# Altium schematic sheet Copy of esp32h2_light_sleep_AI.SchDoc
size A4; SheetNumber: 1; SheetTotal: 1
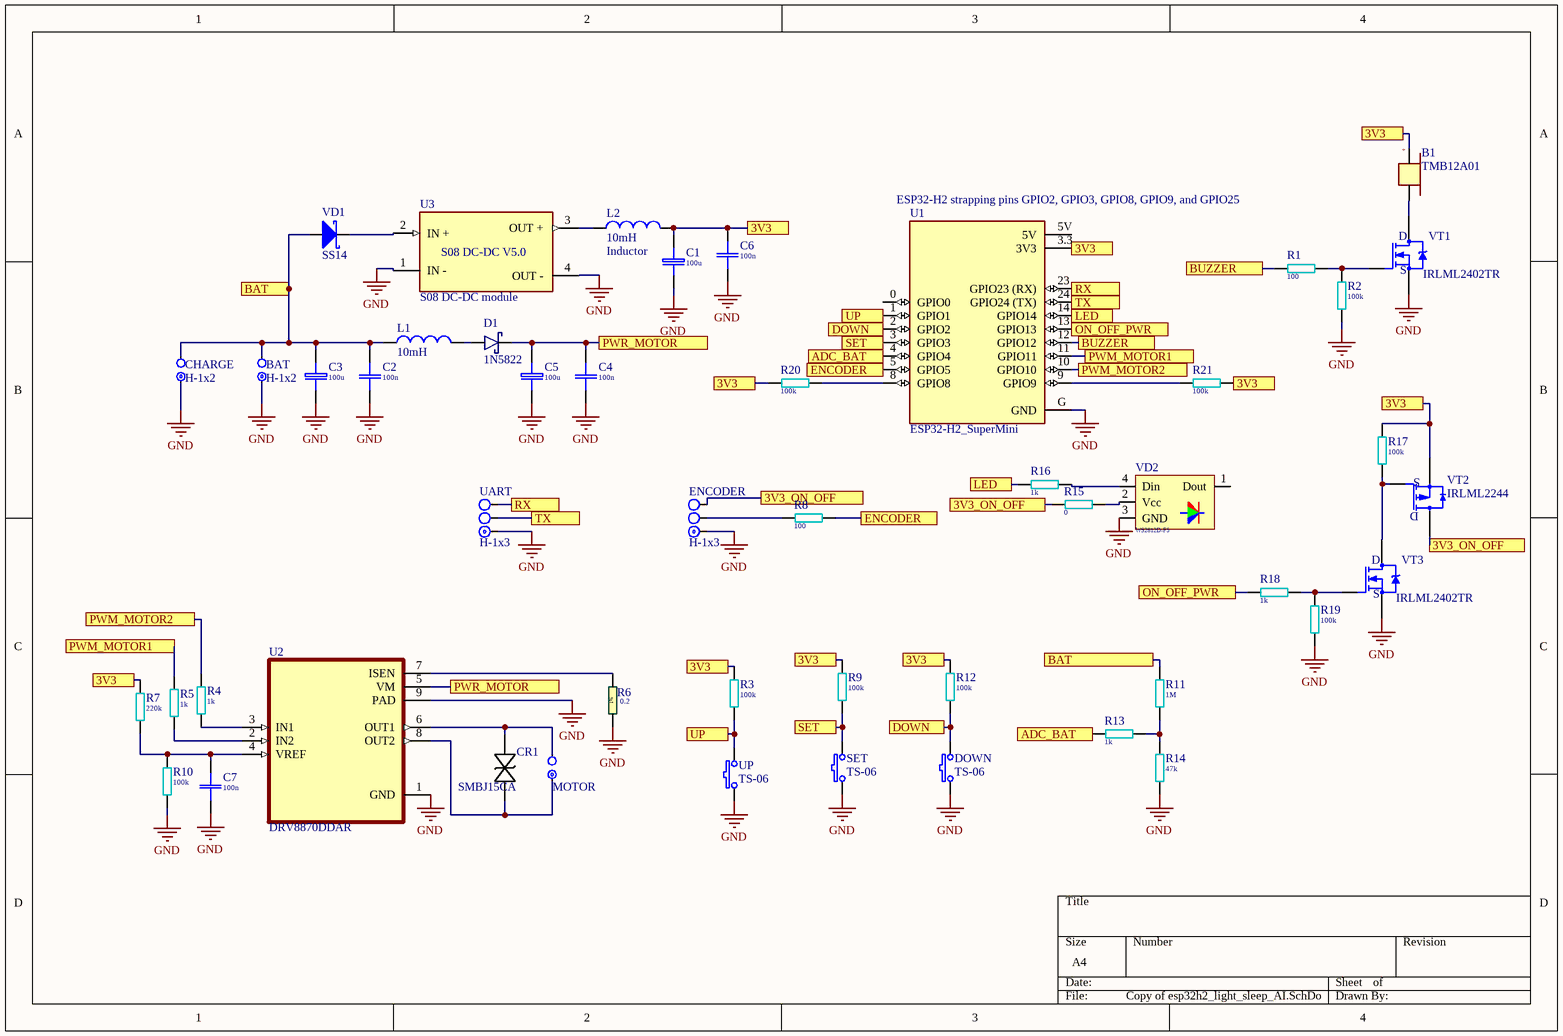
[diagram p0: Copy of esp32h2_light_sleep_AI.SchDoc]

## Parts
B1  value TMB12A01  [Buzzer_TMB12AXX]
BAT  H-1x2  [J1x2]
C1  100u  [EL SMD Case D D6.3x6.6 h7.7(0605)]
C2  100n  [C1206(3216)]
C3  100u  [EL SMD Case D D6.3x6.6 h7.7(0605)]
C4  100n  [C1206(3216)]
C5  100u  [EL SMD Case D D6.3x6.6 h7.7(0605)]
C6  100n  [C1206(3216)]
C7  100n  [C1206(3216)]
CHARGE  H-1x2  [J1x2]
CR1  SMBJ15CA  [DIODE_DO214AA]
D1  1N5822  [DO201AD]
DOWN  TS-06  [TS-06]
ENCODER  H-1x3  [J1x3]
L1  value 10mH  [AXIAL-10x0.8]
L2  Inductor  value 10mH  [AXIAL-10x0.8]
MOTOR  H-1x2  [J1x2]  (value not drawn)
R1  100  [R1206]
R2  100k  [R1206]
R3  100k  [R1206]
R4  1k  [R1206]
R5  1k  [R1206]
R6  0.2  [R2512-1%]
R7  220k  [R1206]
R8  100  [R1206]
R9  100k  [R1206]
R10  100k  [R1206]
R11  1M  [R1206]
R12  100k  [R1206]
R13  1k  [R1206]
R14  47k  [R1206]
R15  0  [R1206]
R16  1k  [R1206]
R17  100k  [R1206]
R18  1k  [R1206]
R19  100k  [R1206]
R20  100k  [R1206]
R21  100k  [R1206]
SET  TS-06  [TS-06]
U1  ESP32-H2_SuperMini  [ESP32-H2_SuperMini]
U2  DRV8870DDAR  [VREG_LM5017MR/NOPB]
U3  S08 DC-DC module  [S08 DC-DC module]
UART  H-1x3  [J1x3]
UP  TS-06  [TS-06]
VD1  SS14  [SMA]
VD2  value WS2812D-F5  [WS2812D-F5 DIP 4 pin]  (hidden comment: XT1511-4020)
VT1  IRLML2402TR  [SOT-23]
VT2  IRLML2244  [SOT-23]
VT3  IRLML2402TR  [SOT-23]

## Ports
3V3 (see esp32h2_light_sleep[1C], esp32h2_light_sleep[2A], esp32h2_light_sleep[2B], esp32h2_light_sleep[2C], esp32h2_light_sleep[3A], esp32h2_light_sleep[3C], esp32h2_light_sleep[4A], esp32h2_light_sleep[4B]), 3V3 (see esp32h2_light_sleep[1C], esp32h2_light_sleep[2A], esp32h2_light_sleep[2B], esp32h2_light_sleep[2C], esp32h2_light_sleep[3A], esp32h2_light_sleep[3C], esp32h2_light_sleep[4B]), 3V3 (see esp32h2_light_sleep[1C], esp32h2_light_sleep[2A], esp32h2_light_sleep[2B], esp32h2_light_sleep[2C], esp32h2_light_sleep[3C], esp32h2_light_sleep[4A], esp32h2_light_sleep[4B]), 3V3 (see esp32h2_light_sleep[1C], esp32h2_light_sleep[2A], esp32h2_light_sleep[2B], esp32h2_light_sleep[3A], esp32h2_light_sleep[3C], esp32h2_light_sleep[4A], esp32h2_light_sleep[4B]), 3V3 (see esp32h2_light_sleep[1C], esp32h2_light_sleep[2A], esp32h2_light_sleep[2C], esp32h2_light_sleep[3A], esp32h2_light_sleep[3C], esp32h2_light_sleep[4A], esp32h2_light_sleep[4B]), 3V3 (see esp32h2_light_sleep[1C], esp32h2_light_sleep[2B], esp32h2_light_sleep[2C], esp32h2_light_sleep[3A], esp32h2_light_sleep[3C], esp32h2_light_sleep[4A], esp32h2_light_sleep[4B]), 3V3 (see esp32h2_light_sleep[2A], esp32h2_light_sleep[2B], esp32h2_light_sleep[2C], esp32h2_light_sleep[3A], esp32h2_light_sleep[3C], esp32h2_light_sleep[4A], esp32h2_light_sleep[4B]), 3V3_ON_OFF (see esp32h2_light_sleep[2B], esp32h2_light_sleep[3B]), 3V3_ON_OFF (see esp32h2_light_sleep[2B], esp32h2_light_sleep[4C]), 3V3_ON_OFF (see esp32h2_light_sleep[3B], esp32h2_light_sleep[4C]), ADC_BAT (see esp32h2_light_sleep[3B]), ADC_BAT (see esp32h2_light_sleep[3C]), BAT (see esp32h2_light_sleep[1B]), BAT (see esp32h2_light_sleep[3C]), BUZZER (see esp32h2_light_sleep[3B]), BUZZER (see esp32h2_light_sleep[4B]), DOWN (see esp32h2_light_sleep[3B]), DOWN (see esp32h2_light_sleep[3C]), ENCODER (see esp32h2_light_sleep[3B]), ENCODER (see esp32h2_light_sleep[3C]), LED (see esp32h2_light_sleep[3B]), ON_OFF_PWR (see esp32h2_light_sleep[3B]), ON_OFF_PWR (see esp32h2_light_sleep[3C]), PWM_MOTOR1 (see esp32h2_light_sleep[1C]), PWM_MOTOR1 (see esp32h2_light_sleep[3B]), PWM_MOTOR2 (see esp32h2_light_sleep[1C]), PWM_MOTOR2 (see esp32h2_light_sleep[3B]), PWR_MOTOR (see esp32h2_light_sleep[2B]), PWR_MOTOR (see esp32h2_light_sleep[2C]), RX (see esp32h2_light_sleep[2B]), RX (see esp32h2_light_sleep[3B]), SET (see esp32h2_light_sleep[3B]), SET (see esp32h2_light_sleep[3C]), TX (see esp32h2_light_sleep[2C]), TX (see esp32h2_light_sleep[3B]), UP (see esp32h2_light_sleep[2C]), UP (see esp32h2_light_sleep[3B])

## Nets
GND: BAT.1 C1.2(-) C2.2 C3.2(-) C4.2 C5.2(-) C6.2 C7.2 CHARGE.1 DOWN.1 ENCODER.1 R2.2 R6.1 R10.1 R14.1 R19.2 SET.1 U1.G(GND) U2.1(GND) U2.9(PAD) U3.1(IN_-) U3.4(OUT_-) UART.1 UP.1 VD2.3(GND) VT1.2(S) VT3.2(S)
3V3: B1.1 C1.1(+) C6.1 L2.2 R3.2 R7.2 R9.2 R12.2 R17.1 R20.2 R21.1 U1.3.3(3V3) VT2.2(S) ; port 3V3
3V3_ON_OFF: ENCODER.3 R15.2 VT2.3(D) ; port 3V3_ON_OFF
ADC_BAT: R13.2 U1.4(GPIO4) ; port ADC_BAT
BAT: BAT.2 C2.1 C3.1(+) CHARGE.2 L1.1 R11.2 VD1.1(A) ; port BAT
BUZZER: R1.2 U1.12(GPIO12) ; port BUZZER
DOWN: DOWN.2 R12.1 U1.2(GPIO2) ; port DOWN
ENCODER: R8.1 U1.5(GPIO5) ; port ENCODER
LED: R16.2 U1.14(GPIO14) ; port LED
ON_OFF_PWR: R18.2 U1.13(GPIO13) ; port ON_OFF_PWR
PWM_MOTOR1: R5.2 U1.11(GPIO11) ; port PWM_MOTOR1
PWM_MOTOR2: R4.2 U1.10(GPIO10) ; port PWM_MOTOR2
PWR_MOTOR: C4.1 C5.1(+) D1.2 U2.5(VM) ; port PWR_MOTOR
RX: U1.23(GPIO23_(RX)) UART.3 ; port RX
SET: R9.1 SET.2 U1.3(GPIO3) ; port SET
TX: U1.24(GPIO24_(TX)) UART.2 ; port TX
UP: R3.1 U1.1(GPIO1) UP.2 ; port UP
NetB1_2: B1.2 VT1.3(D)
NetC7_1: C7.1 R7.1 R10.2 U2.4(VREF)
NetCR1_1: CR1.1 MOTOR.2 U2.6(OUT1)
NetCR1_2: CR1.2 MOTOR.1 U2.8(OUT2)
NetD1_1: D1.1 L1.2
NetENCODER_2: ENCODER.2 R8.2
NetL2_1: L2.1 U3.3(OUT_+)
NetR1_1: R1.1 R2.1 VT1.1(G)
NetR4_1: R4.1 U2.3(IN1)
NetR5_1: R5.1 U2.2(IN2)
NetR6_2: R6.2 U2.7(ISEN)
NetR11_1: R11.1 R13.1 R14.2
NetR15_1: R15.1 VD2.2(Vcc)
NetR16_1: R16.1 VD2.4(Din)
NetR17_2: R17.2 VT2.1(G) VT3.3(D)
NetR18_1: R18.1 R19.1 VT3.1(G)
NetR20_1: R20.1 U1.8(GPIO8)
NetR21_2: R21.2 U1.9(GPIO9)
NetU3_2: U3.2(IN_+) VD1.2(2.)

Not connected (* = marked no-connect by the designer): U1 0(GPIO0) 5V; VD2 1(Dout)

## Notes on the sheet
- (near U1) ESP32-H2 strapping pins GPIO2, GPIO3, GPIO8, GPIO9, and GPIO25
- (in symbol B) +
- (in symbol R-2512-1%) 1%
- (in symbol S08 DC-DC module) S08 DC-DC V5.0

## Library data of the parts
B1 = B: Active Buzzer 1.5/3.0V 75DB; Montage: Выводной; Contacts: 2; Family: Пищалка
C1 C3 C5 = EL 100u/35V-2: EL 35V SMD Case D D6.3x6.6 h7.7(0605); Price: 0.014; Value: 100u
C2 C4 C6 C7 = C-1206: SMD-1206; Price: 0.014; Value: 100n
CR1 = SMBJ15CA: Description; Manufacturer_Name: Bourns Electronics; Copyright: Copyright (C) 2026 Ultra Librarian. All rights reserved.; Manufacturer_Part_Number: SMBJ15CA
D1 = 1N5822: Diode Schottky 40V 3A DO201AD; Digikey PN: 497-11370-1-ND; Mouser PN: 511-1N5822; JLCPCB PN: C3018526
DOWN SET UP = Buton TS-06: Price: 0.15
L1 L2 = Inductor: Code_IEC: 1005; Published: 8-Jun-2000; LatestRevisionDate: 29-May-2009; LatestRevisionNote: IPC-7351 Footprint Added.; PackageReference: 0402-A; Publisher: Altium Limited; PackageDescription: Chip Inductor; Code_JEITA: 0402
R1-R5 R7-R21 = R-1206: SMD 1206 0.125W 5% 200V; Price: 0.045
  R1 R8: Value: 100
  R2 R3 R9 R10 R12 R17 R19-R21: Value: 100k
  R4 R5 R13 R16 R18: Value: 1k
  R7: Value: 220k
  R11: Value: 1M
  R14: Value: 47k
  R15: Value: 0
R6 = R-2512-1%: SMD 2512 1W 1% 200V; Price: 0.288; Value: 0.2
U1 = ESP32-H2_SuperMini: Zero ESP32-H2 board; MF: Espressif Systems; MP: ESP32-C3 Zero; Package: Package; Value: *; Check_prices: https://www.snapeda.com/parts/ESP32-C3%20SuperMini_TH/Espressif+Systems/view-part/?ref=eda
U2 = DRV8870DDAR: å…·æœ‰ç”µæµè°ƒèŠ‚åŠŸèƒ½çš„ 50 Vã€3.6 A H æ¡¥ç”µæœºé©±åŠ¨å™¨; MF: Texas Instruments; SnapEDA_Link: https://www.snapeda.com/parts/DRV8870DDAR/Texas+Instruments/view-part/?ref=snap; Package: HSOIC-8 Texas Instruments; Value: *; MP: DRV8870DDAR; Check_prices: https://www.snapeda.com/parts/DRV8870DDAR/Texas+Instruments/view-part/?ref=eda
U3 = S08 DC-DC module: S08 DC-DC module V5.0; MF: Espressif Systems; MP: ESP32-C3 Zero; Package: Package; Value: *; Check_prices: https://www.snapeda.com/parts/ESP32-C3%20SuperMini_TH/Espressif+Systems/view-part/?ref=eda
VD1 = VD_8: DIODE SMD Шоттки SS14 1A 40v SMA; Manufacturer: Diodes Inc.; Voltage: 20v; Family: Диод; Montage: SMD; Type: Шоттки; Package: SMA; Current: 1A; Value: SS14
VD2 = WS2812D-F5: DIP RGB Адресуемый светодиод аналог WS2812; Manufacturer: EZIUSIN; Montage: SMD; Voltage: 2.0/3.0v; Current: 0.005A; Family: Диод RGB; Type: Светодиод; Package: 4020; PartNumber: XT1511-4020; Vender: https://ru.aliexpress.com/store/product/Jercio-50-1500-XT1511-4020-WS2812b-SK6812-4020-RGB-DC-5/4170004_32890356895.html?ws_ab_test=searchweb0_0%2Csearchweb201602_1_5724111_10065_5930011_10068_5724211_5890011_5724311_10696_5724011_10084_10083_10618_5940011_5970011_10307_5723511_10301_5920011_5910011_5724411_10059_5900011_100031_5725111_10103_5724811_5725011_5990011_5724911_5980011%2Csearchweb201603_56%2CppcSwitch_2&algo_expid=625c825e-e2ae-42fa-880c-28dc549fd929-13&algo_pvid=625c825e-e2ae-42fa-880c-28dc549fd929&transAbTest=ae803_1&priceBeautifyAB=0
VT1 VT3 = VT_2: TRANSISTOR SMD MOSFET IRLML0040 3.6A 40v 0.078Ω SOT23; Manufacturer: International Rectifier; Structure: N-channel; Family: Транзистор; Montage: SMD; Type: MOSFET; Voltage: 40v; Package: SOT23; Current: 3.6A; Resistance: 0.078Ω; Value: IRLML2402TR
VT2 = VT_5: FET-P SMD IRLML6402 3.7A 20v 0.065Ω SOT23; Manufacturer: International Rectifier; Type: MOSFET; Structure: P-channel; Family: Транзистор; Montage: SMD; Voltage: 20v; Package: SOT23; Current: 3.7A; Resistance: 0.065Ω; Value: IRLML2244
BAT CHARGE MOTOR = H-1x2: Price: 0.02
ENCODER UART = H-1x3: Price: 0.03